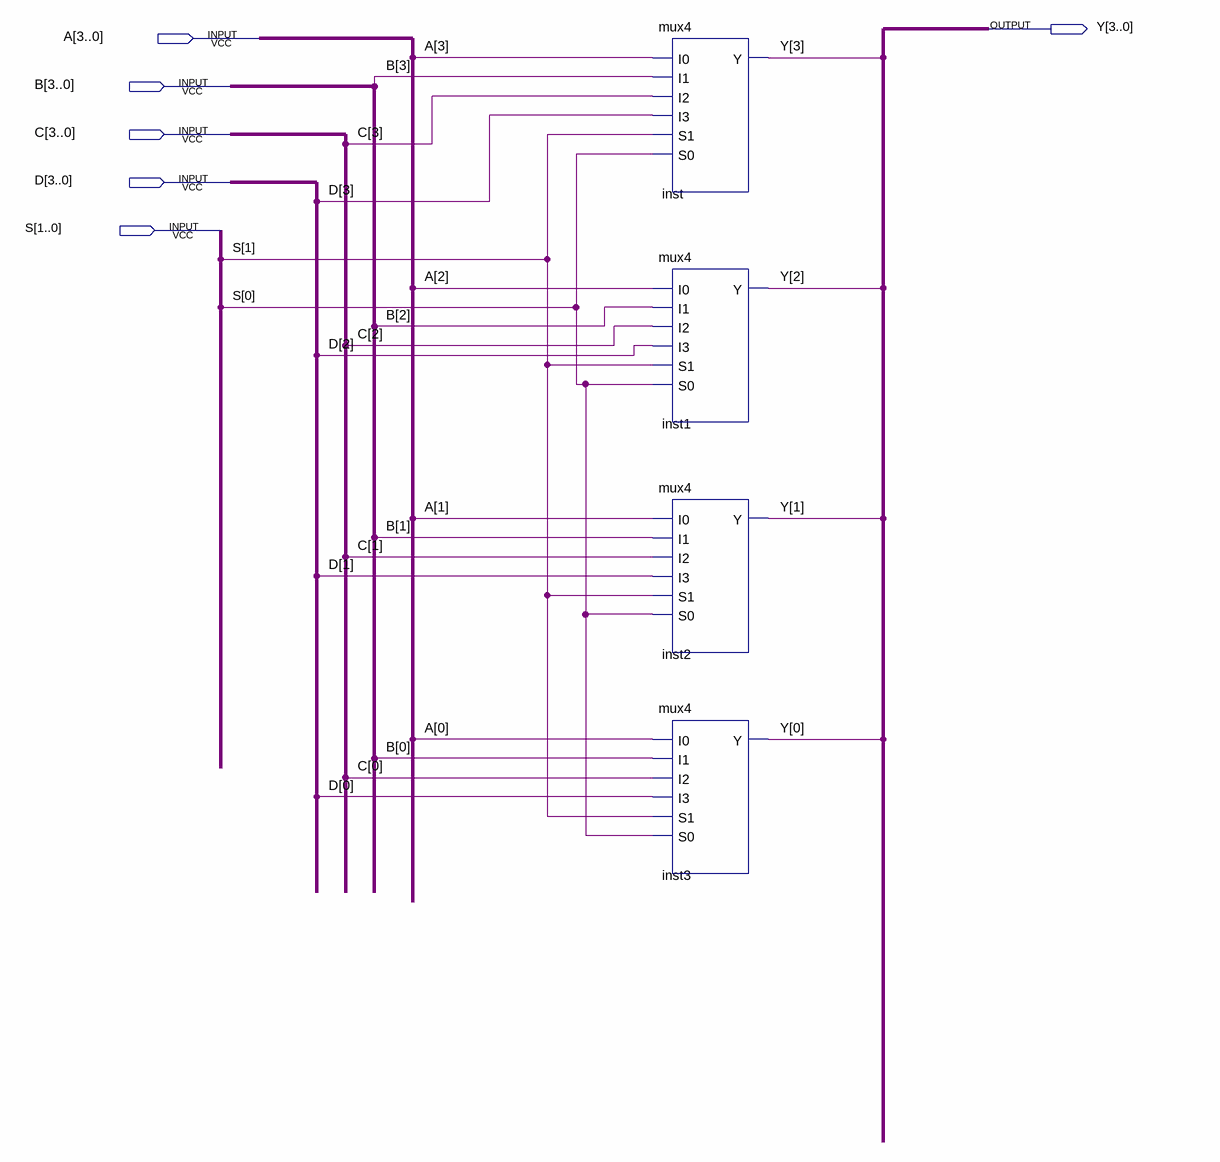
[diagram p0: schematic sheet]
// Quartus schematic muxbus.bdf as structural Verilog: 4 symbols, 6 pins
module muxbus (
  input  [3:0] A,
  input  [3:0] B,
  input  [3:0] C,
  input  [3:0] D,
  input  [1:0] S,
  output [3:0] Y
);

  mux4 inst (.I0(A[3]), .I1(B[3]), .I2(C[3]), .I3(D[3]), .S1(S[1]), .S0(S[0]), .Y(Y[3]));
  mux4 inst1 (.I0(A[2]), .I1(B[2]), .I2(C[2]), .I3(D[2]), .S1(S[1]), .S0(S[0]), .Y(Y[2]));
  mux4 inst2 (.I0(A[1]), .I1(B[1]), .I2(C[1]), .I3(D[1]), .S1(S[1]), .S0(S[0]), .Y(Y[1]));
  mux4 inst3 (.I0(A[0]), .I1(B[0]), .I2(C[0]), .I3(D[0]), .S1(S[1]), .S0(S[0]), .Y(Y[0]));
endmodule
